# EAGLE design headers (EAGLE 8.1.0)
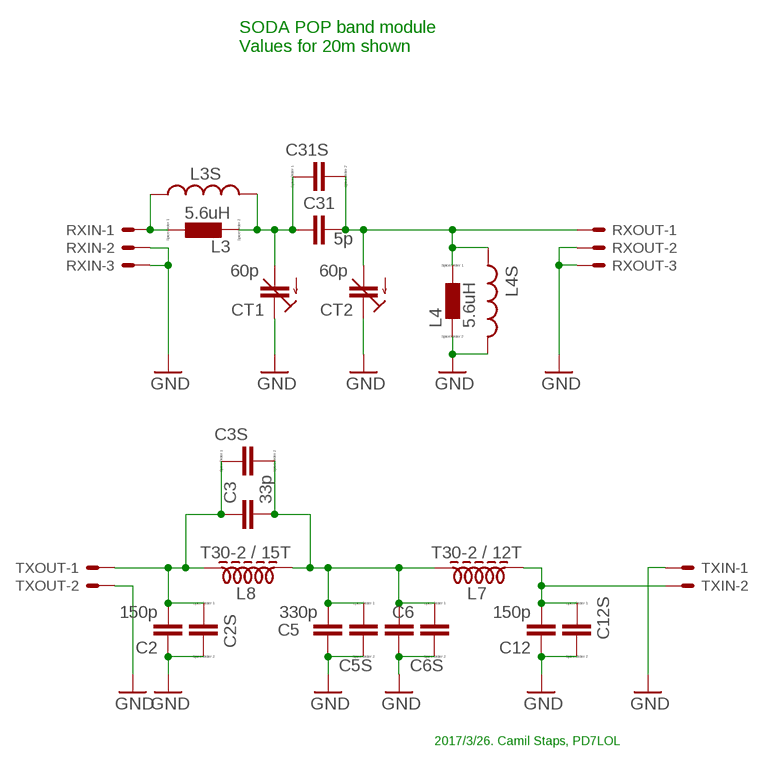
[diagram p0: schematic, sheet 1]

## Parts
C2  150p  C5/2.5  [C5B2.5]
C2S  CC0603  [C0603]
C3  33p  C5/2.5  [C5B2.5]
C3S  CC0603  [C0603]
C5  330p  C5/2.5  [C5B2.5]
C5S  CC0603  [C0603]
C6  330p  C5/2.5  [C5B2.5]
C6S  CC0603  [C0603]
C12  150p  C5/2.5  [C5B2.5]
C12S  CC0603  [C0603]
C31  5p  C5/2.5  [C5B2.5]
C31S  CC0603  [C0603]
CT1  60p  C-TRIMMTZ03  [CTRIMTZ03]
CT2  60p  C-TRIMMTZ03  [CTRIMTZ03]
L3  5.6uH  L0207/10  [0207/10]
L3S  L-USL2012C  [L2012C]
L4  5.6uH  L0207/10  [0207/10]
L4S  L-USL2012C  [L2012C]
L7  T30-2 / 12T  INDUCTORT30-2-28AWG-15T  [T30-2-28AWG-15T]
L8  T30-2 / 15T  INDUCTORT30-2-28AWG-15T  [T30-2-28AWG-15T]
RXIN  22-23-2031  [22-23-2031]
RXOUT  22-23-2031  [22-23-2031]
TXIN  22-23-2021  [22-23-2021]
TXOUT  22-23-2021  [22-23-2021]

## Nets
GND: C2.1 C2S.2 C5.1 C5S.2 C6.1 C6S.2 C12.1 C12S.2 CT1.1(E) CT2.1(E) L4.2 L4S.2 RXIN.2 RXIN.3 RXOUT.2 RXOUT.3 TXIN.1 TXOUT.2
N$1: L3.1 L3S.1 RXIN.1
N$2: C31.1 C31S.1 CT1.2(A) L3.2 L3S.2
N$4: C31.2 C31S.2 CT2.2(A) L4.1 L4S.1 RXOUT.1
N$5: C3.2 C3S.2 C5.2 C5S.1 C6.2 C6S.1 L7.P$2 L8.P$1
N$6: C12.2 C12S.1 L7.P$1 TXIN.2
N$8: C2.2 C2S.1 C3.1 C3S.1 L8.P$2 TXOUT.1

## Notes on the sheet
- SODA POP band module
  Values for 20m shown
- 2017/3/26. Camil Staps, PD7LOL

## Library data of the parts
C2 C3 C5 C6 C12 C31 = capacitor-wima:C: CAPACITOR naming: grid - package width
C2S C3S C5S C6S C12S C31S = eagle-ltspice:C: CAPACITOR, European symbol; SPICEMODEL: NONE; SPICEPREFIX: C
CT1 CT2 = rcl:C-TRIMM: Trimm capacitor
L3 L4 = eagle-ltspice:L: INDUCTOR, European symbol; SPICEMODEL: NONE; SPICEPREFIX: L
L3S L4S = rcl:L-US: INDUCTOR, American symbol
L7 L8 = toroids:INDUCTOR: Inductor on toroid
RXIN RXOUT = con-molex:22-23-2031: .100" (2.54mm) Center Header - 3 Pin; MF: MOLEX; MPN: 22-23-2031; OC_FARNELL: 1462950; OC_NEWARK: 30C0862
TXIN TXOUT = con-molex:22-23-2021: .100" (2.54mm) Center Header - 2 Pin; MF: MOLEX; MPN: 22-23-2021; OC_FARNELL: 1462926; OC_NEWARK: 25C3832

## Board
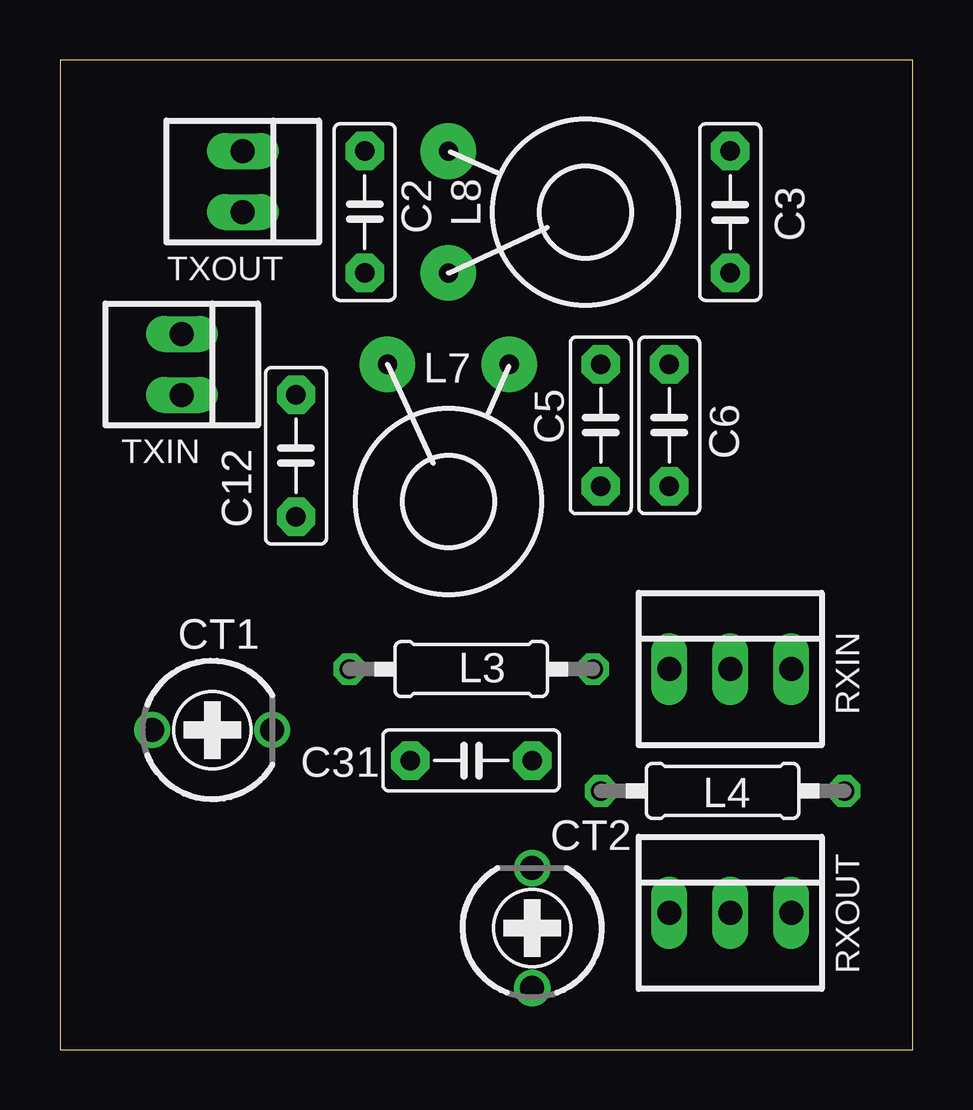
[diagram p1: board, top side]
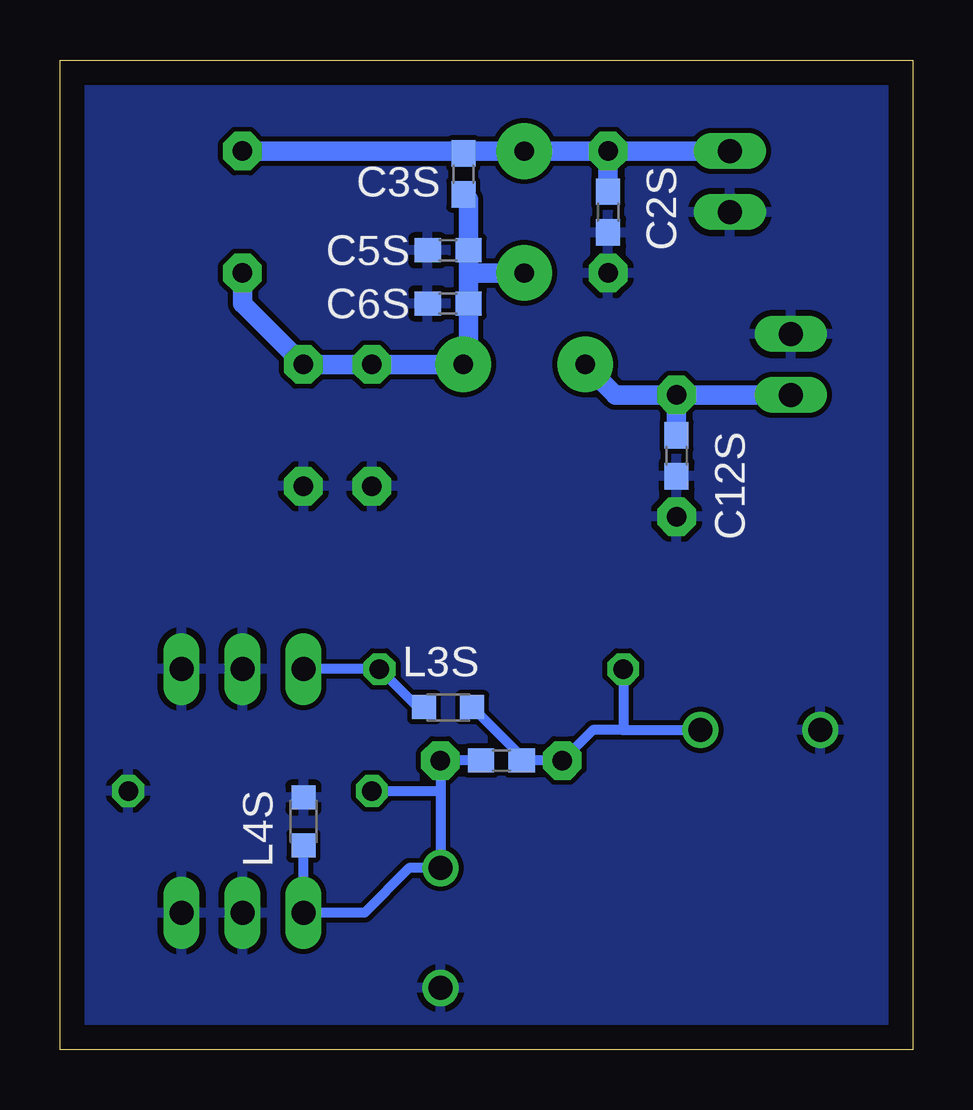
[diagram p2: board, bottom side, seen from below]

Size 35.55 x 41.27 mm. Coordinates in mm from the lower left corner, seen from the top.
Outline: 0,0 35.55,0 35.55,41.27 0,41.27 0,0
Copper layers (1*16): Top 0.035mm / dielectric 1.5mm / Bottom 0.035mm
Design rules "default": minimum track width 10mil, minimum drill 24mil, track to track 8mil, track to pad 8mil, pad to pad 8mil, via to via 8mil, smd to smd 8mil, copper to edge 40mil, drill to drill 8mil, minimum pad ring 10mil, minimum via ring 8mil, stop-mask expansion 4mil, vias tented up to drill 0mil, thermal gap 10mil

### Footprints (pad centres in the part's own frame; a part is rotated, then mirrored left to right if it is on the bottom)
C5B2.5 = drill 0.813 pad 1.6 octagon: 1 -2.54,0; 2 2.54,0
C0603 = smd 1.1 x 1: 1 -0.85,0; 2 0.85,0
CTRIMTZ03 = drill 1: 1 0,2.5; 2 0,-2.5
0207/10 = drill 0.813 octagon: 1 -5.08,0; 2 5.08,0
L2012C = smd 1 x 1: 1 -1,0; 2 1,0
T30-2-28AWG-15T = drill 0.8 pad 2.32: P$1 0,0; P$2 5.08,0
22-23-2031 = drill 1 long: 1 -2.54,0; 2 0,0; 3 2.54,0
22-23-2021 = drill 1 long: 1 -1.27,0; 2 1.27,0

### Placement (x,y rotation side)
C2  12.7,34.92 90 top
C2S  12.7,34.92 270 bottom
C3  27.94,34.92 270 top
C3S  18.73,36.51 270 bottom
C5  22.54,26.04 90 top
C5S  19.37,33.34 180 bottom
C6  25.4,26.04 90 top
C6S  19.37,31.11 180 bottom
C12  9.84,24.77 90 top
C12S  9.84,24.77 270 bottom
C31  17.14,12.06 0 top
C31S  17.14,12.06 180 bottom
CT1  6.35,13.34 90 top
CT2  19.68,5.08 180 top
L3  17.14,15.88 180 top
L3S  19.37,14.29 0 bottom
L4  27.62,10.79 0 top
L4S  25.4,9.53 90 bottom
L7  13.65,28.57 0 top
L8  16.19,32.38 90 top
RXIN  27.94,15.88 0 top
RXOUT  27.94,5.71 0 top
TXIN  5.08,28.57 270 top
TXOUT  7.62,36.2 270 top

### Tracks (layer width: path | path; a pad name or v marks a point on that pad's centre or on a via)
GND
  pour Bottom: 0,41.27 35.56,41.27 35.56,0 0,0
N$1
  Bottom 0.406: RXIN.1 L3.1 20.64,14.29 L3S.1
N$2
  Bottom 0.406: L3.2 12.06,13.34 | 12.06,13.34 CT1.2 | 12.06,13.34 13.34,13.34 C31.1 C31S.1 16.3,12.21 L3S.2
N$4
  Bottom 0.406: 19.68,10.79 C31.2 C31S.2 | L4.1 19.68,10.79 | 19.68,10.79 CT2.2 21,7.58 22.86,5.71 RXOUT.1 L4S.1
N$5
  Bottom 0.406: 18.73,33.55 C5S.1
  Bottom 0.813: C3.2 27.94,31.11 C6.2 C5.2 L7.P$2 18.52,28.79 C6S.1 18.52,32.38 | C3S.2 18.52,35.45 C5S.1 18.52,32.38 | L8.P$1 18.52,32.38
N$6
  Bottom 0.813: C12.2 TXIN.2 | C12.2 12.38,27.3 L7.P$1 | C12S.1 C12.2
N$8
  Bottom 0.406: 18.63,37.47 C3S.1
  Bottom 0.813: C2.2 L8.P$2 18.73,37.47 | TXOUT.1 C2.2 | 18.73,37.47 C3.1 | C3S.1 18.73,37.47 | C2S.1 C2.2